# Altium schematic sheet schematics.SchDoc
size A4; SheetNumber: 1; SheetTotal: 1
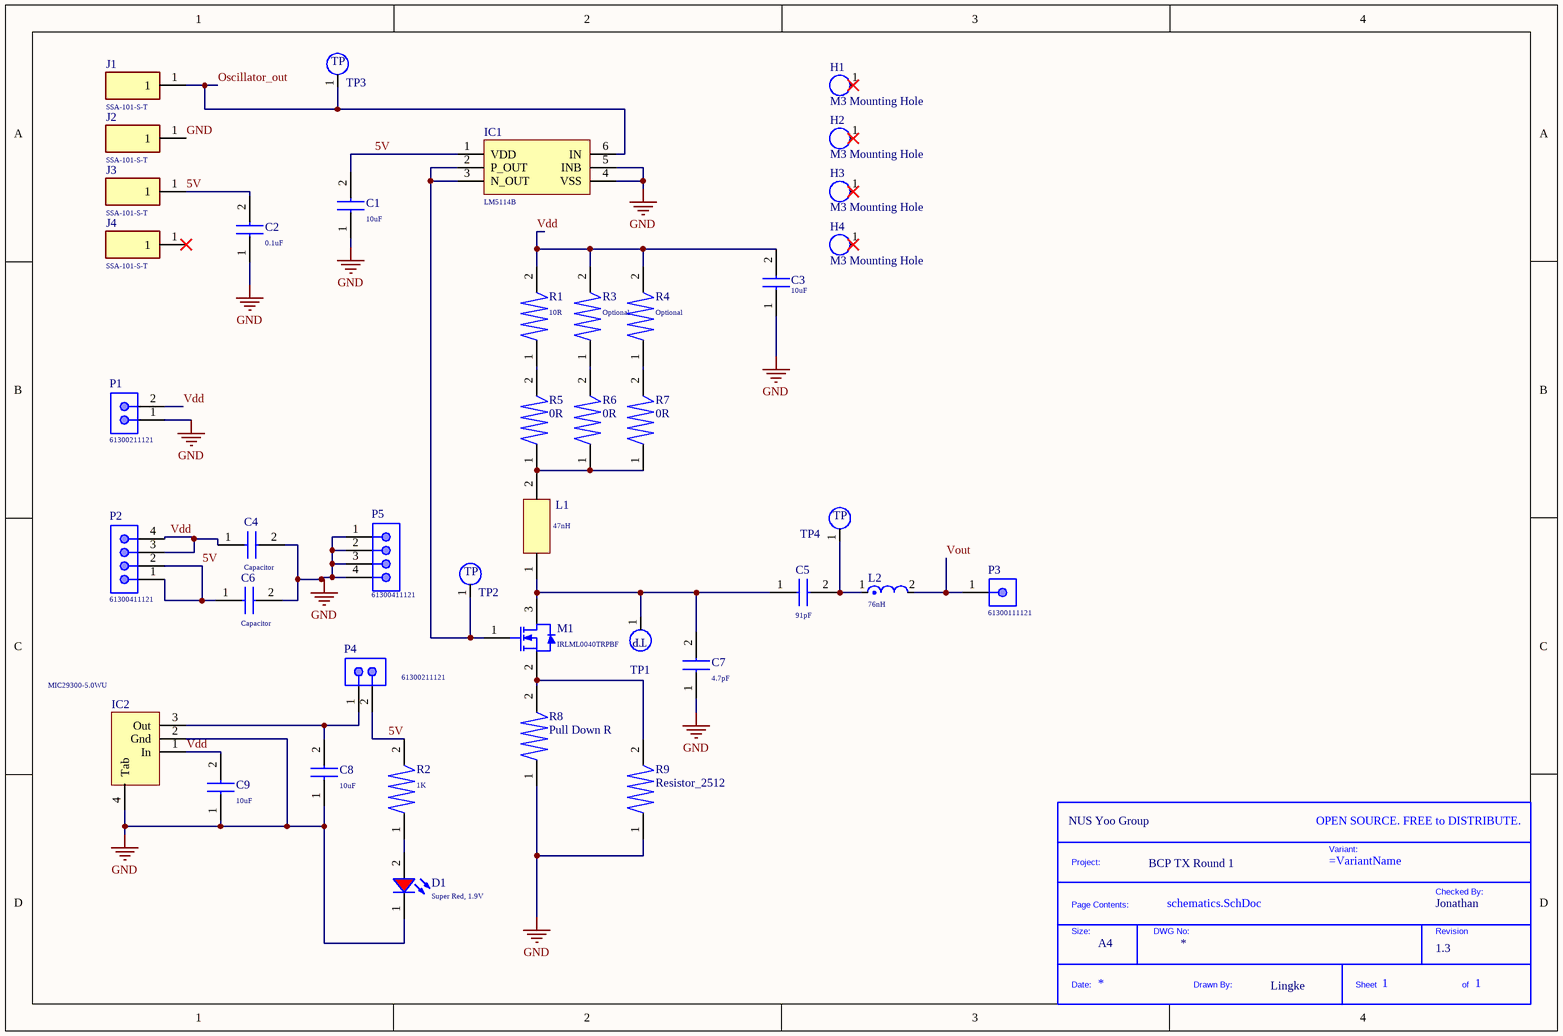
[diagram p0: schematics.SchDoc]

## Parts
*?  Project Name: BCP TX Round 1  Company: NUS Yoo Group  Drawn By: Lingke  Revision: 1.3  Size: A4  Checked By: Jonathan  (hidden comment: Title_Block)  (no BOM)
C1  10uF  [0603]
C2  0.1uF  [0603]
C3  10uF  [0603]
C4  Capacitor  [0603]
C5  91pF  [0603]
C6  Capacitor  [0603]
C7  4.7pF  [0603]
C8  10uF  [0603]
C9  10uF  [0603]
D1  Super Red, 1.9V  [WL-SMCW_0603_H=0.7mm]
H1  M3 Mounting Hole  [M3 Hole]
H2  M3 Mounting Hole  [M3 Hole]
H3  M3 Mounting Hole  [M3 Hole]
H4  M3 Mounting Hole  [M3 Hole]
IC1  LM5114B  [SOT-23-6]
IC2  MIC29300-5.0WU  [TO-263-3]
J1  SSA-101-S-T  [SSA-101-S-X]
J2  SSA-101-S-T  [SSA-101-S-X]
J3  SSA-101-S-T  [SSA-101-S-X]
J4  SSA-101-S-T  [SSA-101-S-X]
L1  47nH  [TPI078060L047N]
L2  76nH  [FP-LQP03PN_02-IPC_A]
M1  IRLML0040TRPBF  [SOT-23]
P1  61300211121  [61300211121]
P2  61300411121  [61300411121]
P3  61300111121  [61300111121]
P4  61300211121  [61300211121]
P5  61300411121  [61300411121]
R1  10R  [2512]
R2  1K  [0603]
R3  Optional  [2512]
R4  Optional  [2512]
R5  0R  [0603]
R6  0R  [0603]
R7  0R  [0603]
R8  Pull Down R  [0603]
R9  Resistor_2512  [2512]
TP1  TP  [Test Point]  (value not drawn)  (no BOM)
TP2  TP  [Test Point]  (value not drawn)  (no BOM)
TP3  TP  [Test Point]  (value not drawn)  (no BOM)
TP4  TP  [Test Point]  (value not drawn)  (no BOM)

## Nets
GND: C1.1 C2.1 C3.1 C4.2 C6.2 C7.1 C8.1 C9.1 D1.1(K) IC1.4(VSS) IC1.5(INB) IC2.2(Gnd) IC2.4(Tab) J2.1 P1.1 P5.1 P5.2 P5.3 P5.4 R8.1 R9.1
5V: C1.2 C2.2 C6.1 IC1.1(VDD) J3.1 P2.1 P2.2 P4.2 R2.2
Oscillator_out: IC1.6(IN) J1.1 TP3.1(TP)
Vdd: C3.2 C4.1 C9.2 IC2.1(In) P1.2 P2.3 P2.4 R1.2 R3.2 R4.2
Vout: L2.2 P3.1
NetC5_1: C5.1 C7.2 L1.1 M1.3(D) TP1.1(TP)
NetC5_2: C5.2 L2.1 TP4.1(TP)
NetC8_2: C8.2 IC2.3(Out) P4.1
NetD1_2: D1.2(A) R2.1
NetIC1_2: IC1.2(P_OUT) IC1.3(N_OUT) M1.1(G) TP2.1(TP)
NetL1_2: L1.2 R5.1 R6.1 R7.1
NetM1_2: M1.2(S) R8.2 R9.2
NetR1_1: R1.1 R5.2
NetR3_1: R3.1 R6.2
NetR4_1: R4.1 R7.2

Not connected (* = marked no-connect by the designer): H1 1*; H2 1*; H3 1*; H4 1*; J4 1*

## Notes on the sheet
- (in symbol Title_Block) OPEN SOURCE. FREE to DISTRIBUTE.; Variant:; Project:; Checked By:; Page Contents:; Size:; DWG No:; Revision; Date:; Drawn By:; Sheet; of

## Library data of the parts
*? = Title_Block: Standard Title Block.; DWG No: *
C1-C3 C5 C7-C9 = Capacitor
D1 = 150060SS75000: WL-SMCW SMT Mono-color Chip LED Waterclear, size 0603, Super Red, 1.9V, 140deg; Chip Technology: AlInGaP; Dominant Wavelength typ.: 630nm; Luminous Intensity typ.: 60mcd; Peak Wavelength typ.: 645nm; Viewing Angle: 140deg; ComponentLink1Description: Manufacturer; ComponentLink1URL: http://www.we-online.de; ComponentLink2URL: https://www.we-online.com/catalog/datasheet/150060SS75000.pdf; ComponentLink2Description: Datasheet; Forward Voltage typ.: 1.9V; Emitting Color: Super Red; Mounting Technology: SMT; Operating Temperature: -40 to +85degC; Published Date: December 2019; Part Number: 150060SS75000; Packaging: Tape and Reel; Size: 0603; Publisher: Wurth Elektronik
H1-H4 = M3_Mounting_hole
J1-J4 = SSA-101-S-T: Connector; Manufacturer_Name: SAMTEC; Datasheet Link: http://suddendocs.samtec.com/prints/ssas-mkt.pdf; Manufacturer_Part_Number: SSA-101-S-T
L1 = TPI078060L047N: Supplier 1: Digi-Key; Supplier Part Number 1: 399-TPI078060L047NCT-ND
L2 = LQP03TN75NH02D: Film type RF Inductor 75nH ±3% 100mA 10Ω 0201 (0603); Shielding: Unshielded; Self Resonant Frequency: 1GHz; Core Material: Non-Magnetic; DC Resistance (DCR): 10R; Test Frequency: 300MHz; Q Factor: 8; Termination: SMD/SMT; Max DC Current: 100mA; Mount: Surface Mount; Width: 0.012inch; Max Operating Temperature: 125°C; Packaging: Tape and Reel; Current Rating: 100mA; Weight: 6E-06oz; RoHS Compliant: Yes; Min Operating Temperature: -55°C; Case/Package: 0201; Resistor Type: Thin Film; Inductance: 75nH; Tolerance: 3%; Package Quantity: 15000; Height: 0.3mm; Case Code (Imperial): 0201; Case Code (Metric): 0603; Length: 0.024inch; Height - Seated (Max): 0.013inch; Supplier 1: Digi-Key; Supplier Part Number 1: 490-13018-1-ND
M1 = IRLML0040TRPBF: HEXFET(R) Power MOSFET, 40 V, -55 to 150 degC, 3-Pin SOT-23, RoHS, Tape and Reel; Manufacturer: International Rectifier; Minimum Gate Threshold Voltage: 1V; Transistor Configuration: Single; Typical Turn-Off Delay Time: 6.4ns; Maximum Gate Threshold Voltage: 2.5V; Channel Type: N; Maximum Gate Source Voltage: ±16V; Channel Mode: Enhancement; Number of Elements per Chip: 1; Maximum Continuous Drain Current: 3.6A; Typical Turn-On Delay Time: 5.1ns; Transistor Material: Si; Typical Input Capacitance @ Vds: 266pF@25V; Maximum Drain Source Resistance: 0.056Ω; Typical Gate Charge @ Vgs: 2.6nC@4.5V; Maximum Power Dissipation: 1.3W; Maximum Drain Source Voltage: 40V; Length: 3.04mm; Height: 1.02mm; Category: PowerMOSFET; Width: 1.4mm; Package Description: 3-Pin Small Outline Transistor, Body 2.92 x 1.3 mm, Pitch 0.95 mm; Pin Count: 3; Package Reference: SOT-23; Datasheet Version: 02/2012; Package Type: SOT-23; Manufacturer URL: http://internationalrectifier.com/; Mounting Technology: SurfaceMount; Dimensions: 3.04x1.4x1.02mm; Maximum Operating Temperature: +150°C; Minimum Operating Temperature: -55°C; Datasheet URL: https://datasheet.ciiva.com/22709/irlml0040pbf-22709201.pdf; Mounting Type: SurfaceMount
P1 P4 = 61300211121: WR-PHD Pin Header, THT, pitch 2.54mm, Single Row, Vertical, 2p; Manufacturer: Wurth Elektronik; Pin Number: 2; Rated Current: 3A; Working Voltage: 250VAC; Withstanding Voltage: 500VAC; Contact Resistance: 20mOhm; ComponentLink1Description: Manufacturer; ComponentLink1URL: http://www.we-online.de; ComponentLink2Description: Datasheet; ComponentLink2URL: https://www.we-online.com/catalog/datasheet/61300211121.pdf; Manufacturer Part Number: 61300211121; Published Date: May 2020; Pitch: 2.54mm; Operating Temperature: -40 to +105degC; Mounting Technology: THT; Packaging: Bag; Gender: Pin Header; Row Number: Single; Orientation: Vertical
P2 P5 = 61300411121: WR-PHD Pin Header, THT, pitch 2.54mm, Single Row, Vertical, 4p; Manufacturer: Wurth Elektronik; Pin Number: 4; Rated Current: 3A; Working Voltage: 250VAC; Withstanding Voltage: 500VAC; Contact Resistance: 20mOhm; ComponentLink1Description: Manufacturer; ComponentLink1URL: http://www.we-online.de; ComponentLink2Description: Datasheet; ComponentLink2URL: https://www.we-online.com/catalog/datasheet/61300411121.pdf; Manufacturer Part Number: 61300411121; Published Date: May 2020; Pitch: 2.54mm; Operating Temperature: -40 to +105degC; Mounting Technology: THT; Packaging: Bag; Gender: Pin Header; Row Number: Single; Orientation: Vertical
P3 = 61300111121: WR-PHD Pin Header, THT, pitch 2.54mm, Single Row, Vertical, 1p; Manufacturer: Wurth Elektronik; Pin Number: 1; Rated Current: 3A; Working Voltage: 250VAC; Withstanding Voltage: 500VAC; Contact Resistance: 20mOhm; ComponentLink1Description: Manufacturer; ComponentLink1URL: http://www.we-online.de; ComponentLink2Description: Datasheet; ComponentLink2URL: https://www.we-online.com/catalog/datasheet/61300111121.pdf; Manufacturer Part Number: 61300111121; Published Date: May 2020; Pitch: 2.54mm; Operating Temperature: -40 to +105degC; Mounting Technology: THT; Packaging: Bag; Gender: Pin Header; Row Number: Single; Orientation: Vertical
R1 R3 R4 R9 = Resistor_2512: Resistor
R2 R5-R8 = Resistor
TP1-TP4 = Test Point: Test Point 1mm by 1mm
IC2 = MIC29300-5.0WU: Supplier 1: Digi-Key; Supplier Part Number 1: 576-1122-ND